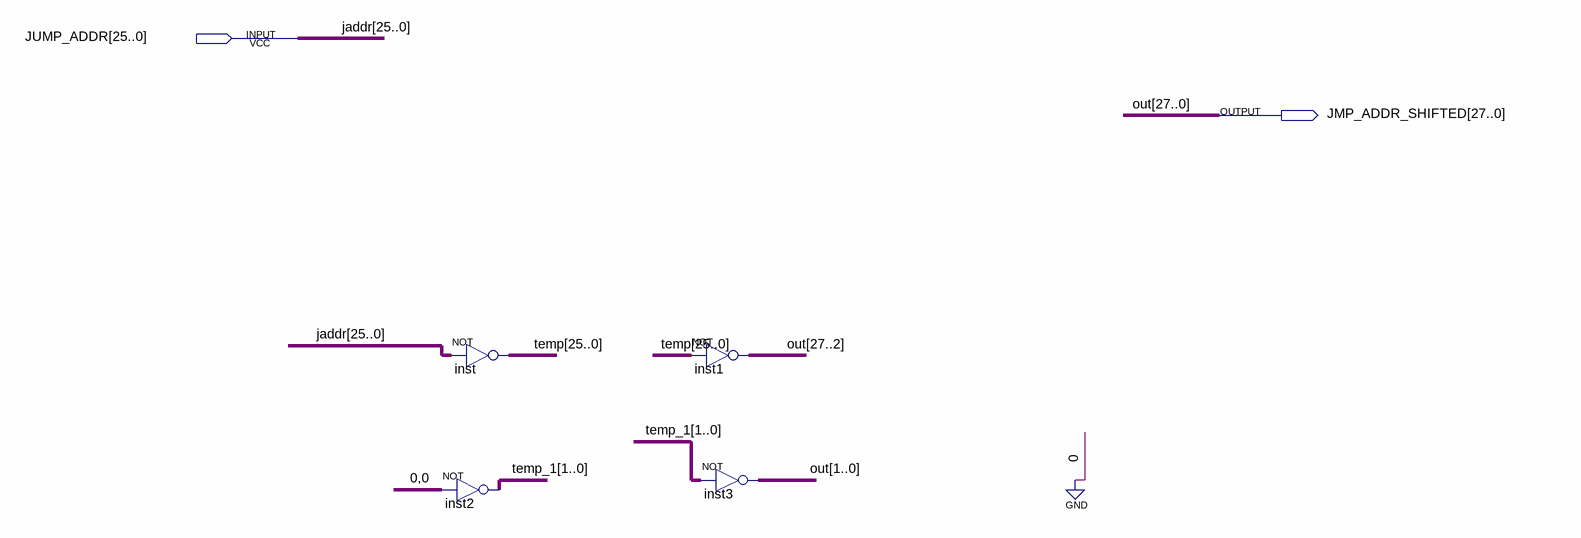
[diagram p0: schematic sheet]
// Quartus schematic jump_addr_shifter.bdf as structural Verilog: 4 symbols, 2 pins
module jump_addr_shifter (
  input  [25:0] JUMP_ADDR,
  output [27:0] JMP_ADDR_SHIFTED
);

  wire [1:0] temp_1;
  wire [25:0] temp;

  assign temp = ~JUMP_ADDR;  // NOT inst, 26 bits wide
  assign temp_1 = ~2'b00;  // NOT inst2, 2 bits wide
  assign JMP_ADDR_SHIFTED[27:2] = ~temp;  // NOT inst1, 26 bits wide
  assign JMP_ADDR_SHIFTED[1:0] = ~temp_1;  // NOT inst3, 2 bits wide

  // Other names for the same wires on the sheet: jaddr[25:0] = JUMP_ADDR; out[27:0] = JMP_ADDR_SHIFTED
endmodule
